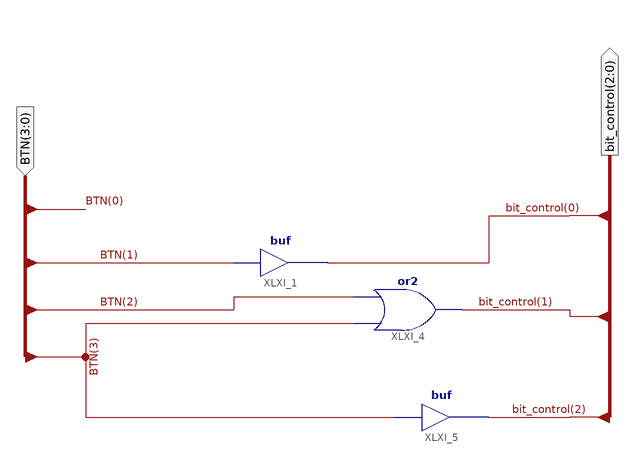
[diagram p0: schematic sheet 1]
// Xilinx ISE schematic Controller.sch (spartan6) as structural Verilog: 3 symbols, 2 ports
module Controller (
  input  [3:0] BTN,
  output [2:0] bit_control
);

  buf XLXI_1 (bit_control[0], BTN[1]);
  or XLXI_4 (bit_control[1], BTN[3], BTN[2]);
  buf XLXI_5 (bit_control[2], BTN[3]);
endmodule
